# Altium schematic sheet Сборочный чертёж.SchDoc
size 209 x 297 mm; ApprovedBy: 1; CheckedBy: 2; Author: 3; SheetNumber: 1; SheetTotal: 1; Разработал: Гончаренко В.Ю.; Проверил: Смолин В.А.; Обозначение: СФ МЭИ ПЭ2-18 11.03.04 03 СБ; Наименование1: Усилитель тока; Наименование2: на дискретных элементах; Тип документа: Сборочный чертёж; Литера2: У; Утвердил: Рассказа Д.С.; Компания: СФ НИУ МЭИ
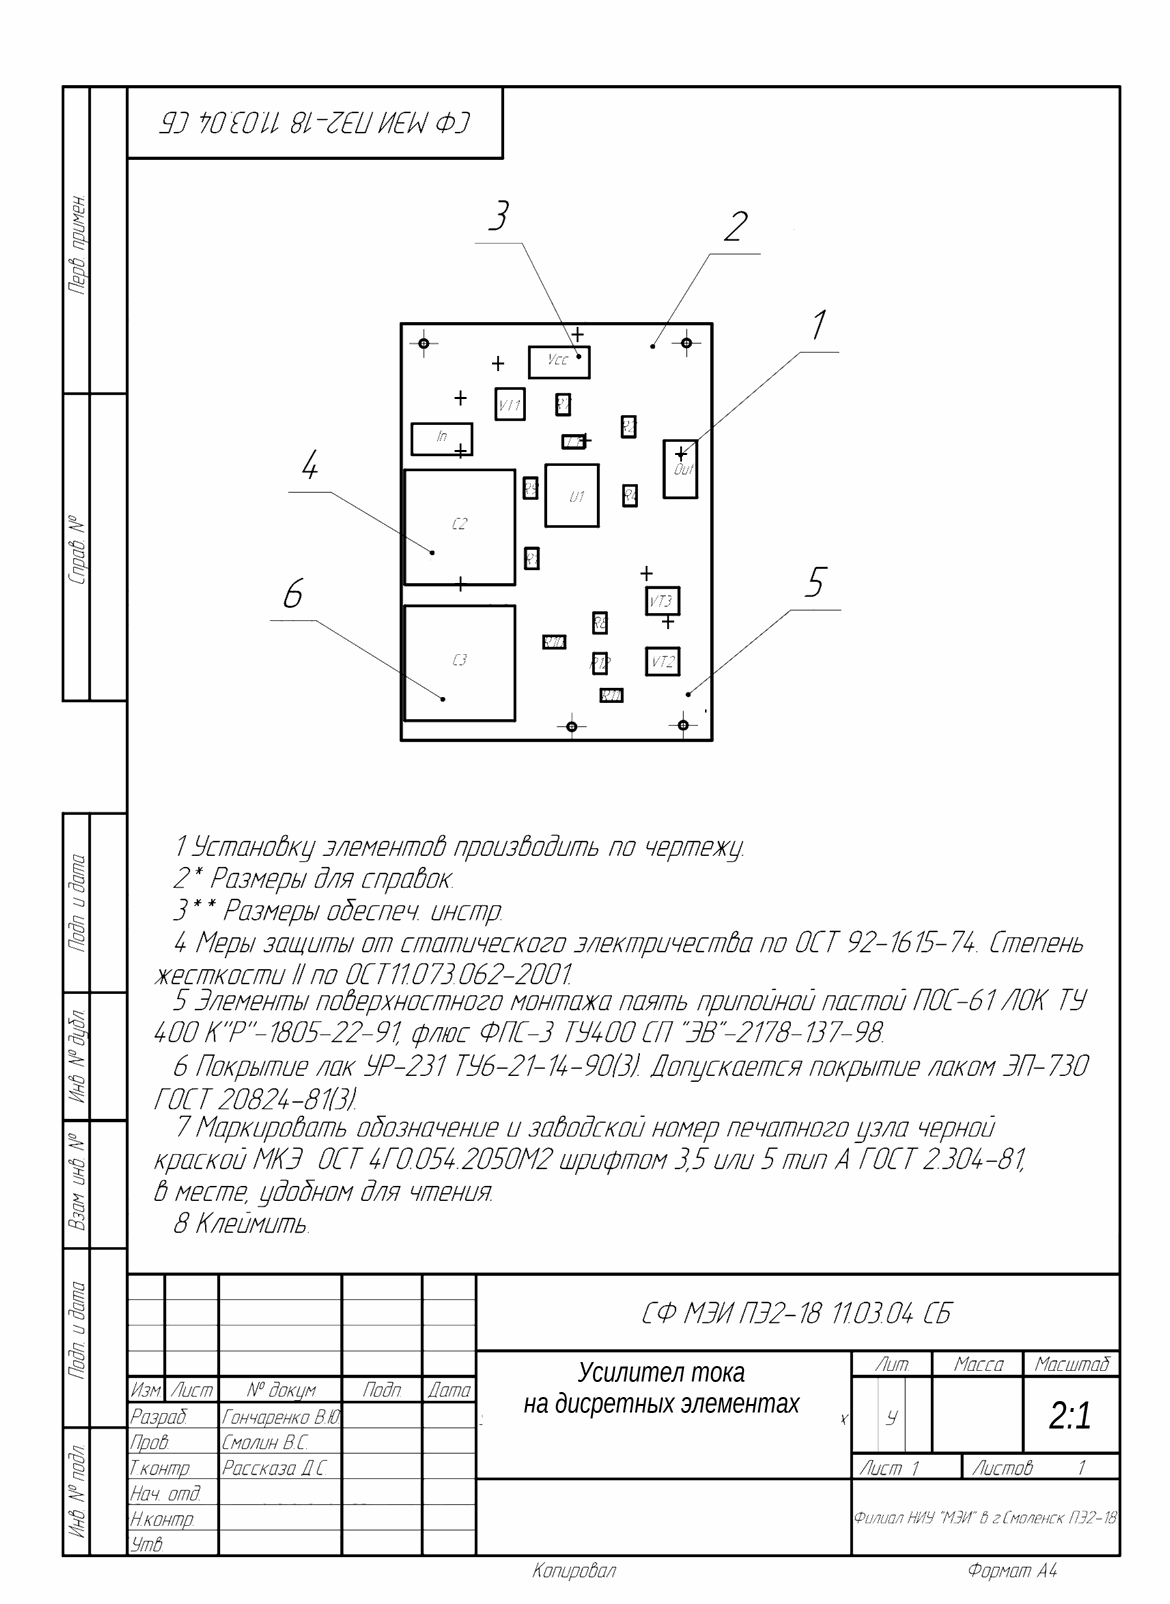
[diagram p0: Сборочный чертёж.SchDoc]

## Notes on the sheet
- +
- Усилител тока
  на дисретных элементах
  Сборочный чертёж
- 2:1